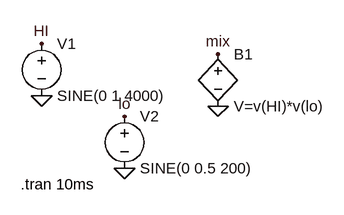
[diagram p0: schematic 18311a1930 DSB-SC.asc]
18311a1930 DSB-SC.asc, the LTspice schematic file:
Version 4
SHEET 1 880 680
FLAG 304 192 0
FLAG 160 208 lo
FLAG 304 112 mix
FLAG 32 96 HI
FLAG 32 176 0
FLAG 160 288 0
SYMBOL voltage 32 80 R0
WINDOW 123 0 0 Left 2
WINDOW 39 0 0 Left 2
SYMATTR InstName V1
SYMATTR Value SINE(0 1 4000)
SYMBOL voltage 160 192 R0
WINDOW 123 0 0 Left 2
WINDOW 39 0 0 Left 2
SYMATTR InstName V2
SYMATTR Value SINE(0 0.5 200)
SYMBOL bv 304 96 R0
SYMATTR InstName B1
SYMATTR Value V=v(HI)*v(lo)
TEXT 0 312 Left 2 !.tran 10ms

The netlist it stands for:
* 18311a1930 DSB-SC.asc
V1 HI 0 SINE(0 1 4000)
V2 lo 0 SINE(0 0.5 200)
B1 mix 0 V=v(HI)*v(lo)
.tran 10ms
.backanno
.end